# Altium schematic sheet OSCILLAR_HFB_V1p0_MAIN.SchDoc
size A4; SheetNumber: 2; SheetTotal: 13; Title_: Main Page
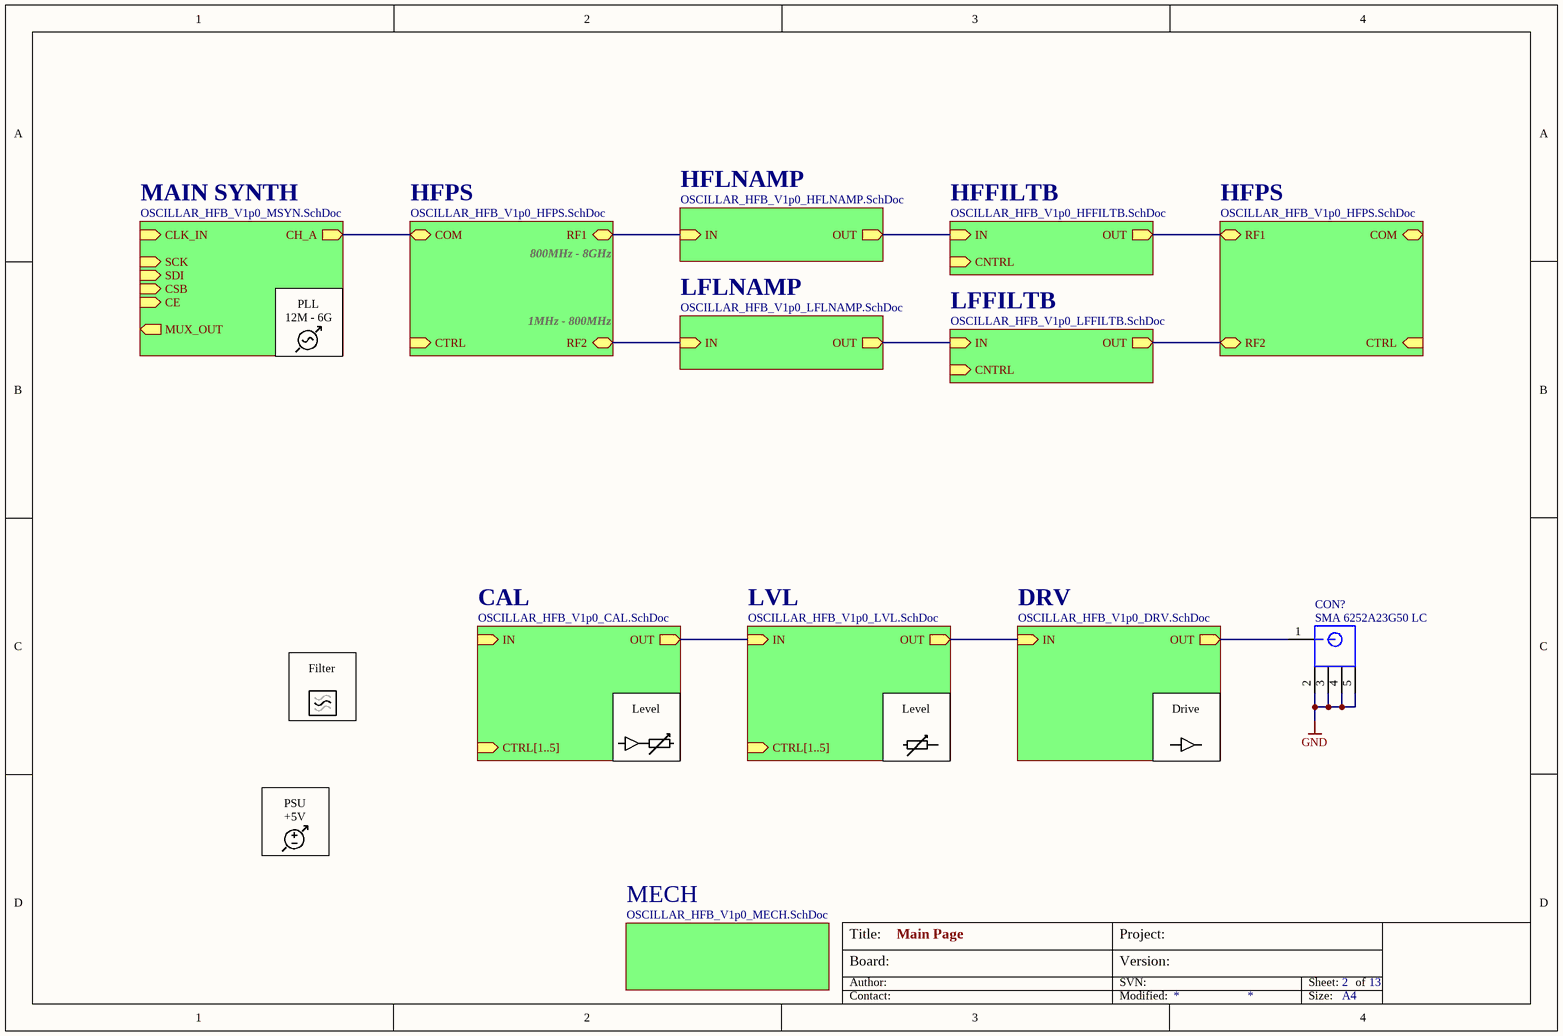
[diagram p0: OSCILLAR_HFB_V1p0_MAIN.SchDoc]

## Parts
CON?  SMA 6252A23G50 LC  [SMA-90]

## Sub-sheets
CAL = OSCILLAR_HFB_V1p0_CAL.SchDoc: IN (in), OUT (out), CTRL[1..5] (in)
DRV = OSCILLAR_HFB_V1p0_DRV.SchDoc: IN (in), OUT (out)
HFFILTB = OSCILLAR_HFB_V1p0_HFFILTB.SchDoc: IN (in), OUT (out), CNTRL (in)
HFLNAMP = OSCILLAR_HFB_V1p0_HFLNAMP.SchDoc: OUT (out), IN (in)
HFPS = OSCILLAR_HFB_V1p0_HFPS.SchDoc: COM (bidir), RF1 (bidir), CTRL (in), RF2 (bidir)
HFPS = OSCILLAR_HFB_V1p0_HFPS.SchDoc: RF1 (bidir), COM (bidir), CTRL (in), RF2 (bidir)
LFFILTB = OSCILLAR_HFB_V1p0_LFFILTB.SchDoc: IN (in), OUT (out), CNTRL (in)
LFLNAMP = OSCILLAR_HFB_V1p0_LFLNAMP.SchDoc: IN (in), OUT (out)
LVL = OSCILLAR_HFB_V1p0_LVL.SchDoc: IN (in), OUT (out), CTRL[1..5] (in)
MAIN SYNTH = OSCILLAR_HFB_V1p0_MSYN.SchDoc: CLK_IN (in), SCK (in), SDI (in), CSB (in), CE (in), MUX_OUT (out), CH_A (out)
MECH = OSCILLAR_HFB_V1p0_MECH.SchDoc: no entries

## Nets
GND: CON?.2 CON?.3 CON?.4 CON?.5
NetCON?_1: CON?.1 ; sheet DRV/OUT
(unnamed): sheet MAIN SYNTH/CH_A, sheet HFPS/COM
(unnamed): sheet CAL/OUT, sheet LVL/IN
(unnamed): sheet LVL/OUT, sheet DRV/IN
(unnamed): sheet HFPS/RF1, sheet HFLNAMP/IN
(unnamed): sheet HFPS/RF2, sheet LFLNAMP/IN
(unnamed): sheet HFPS/RF1, sheet HFFILTB/OUT
(unnamed): sheet HFPS/RF2, sheet LFFILTB/OUT
(unnamed): sheet HFLNAMP/OUT, sheet HFFILTB/IN
(unnamed): sheet LFLNAMP/OUT, sheet LFFILTB/IN

## Notes on the sheet
- 800MHz - 8GHz
- PLL
  12M - 6G
- 1MHz - 800MHz
- Filter
- Level
- Drive
- PSU
  +5V
- Board:
- Author:
- Title:
- Project:
- SVN:
- Version:
- Sheet:
- of
- Contact:
- Modified:
- Size:
- A4

## Library data of the parts
CON? = SMA 6252A23G50 LC: SMA female, 90°; Part number: 100.310.40; Type: CON; Supplier: Hestore; ComponentLink1Description: Datasheet; ComponentLink2Description: Order; ComponentLink2URL: https://www.hestore.hu/prod_10031040.html